# EAGLE design SD2IEC TicTac (EAGLE 7.7.0)
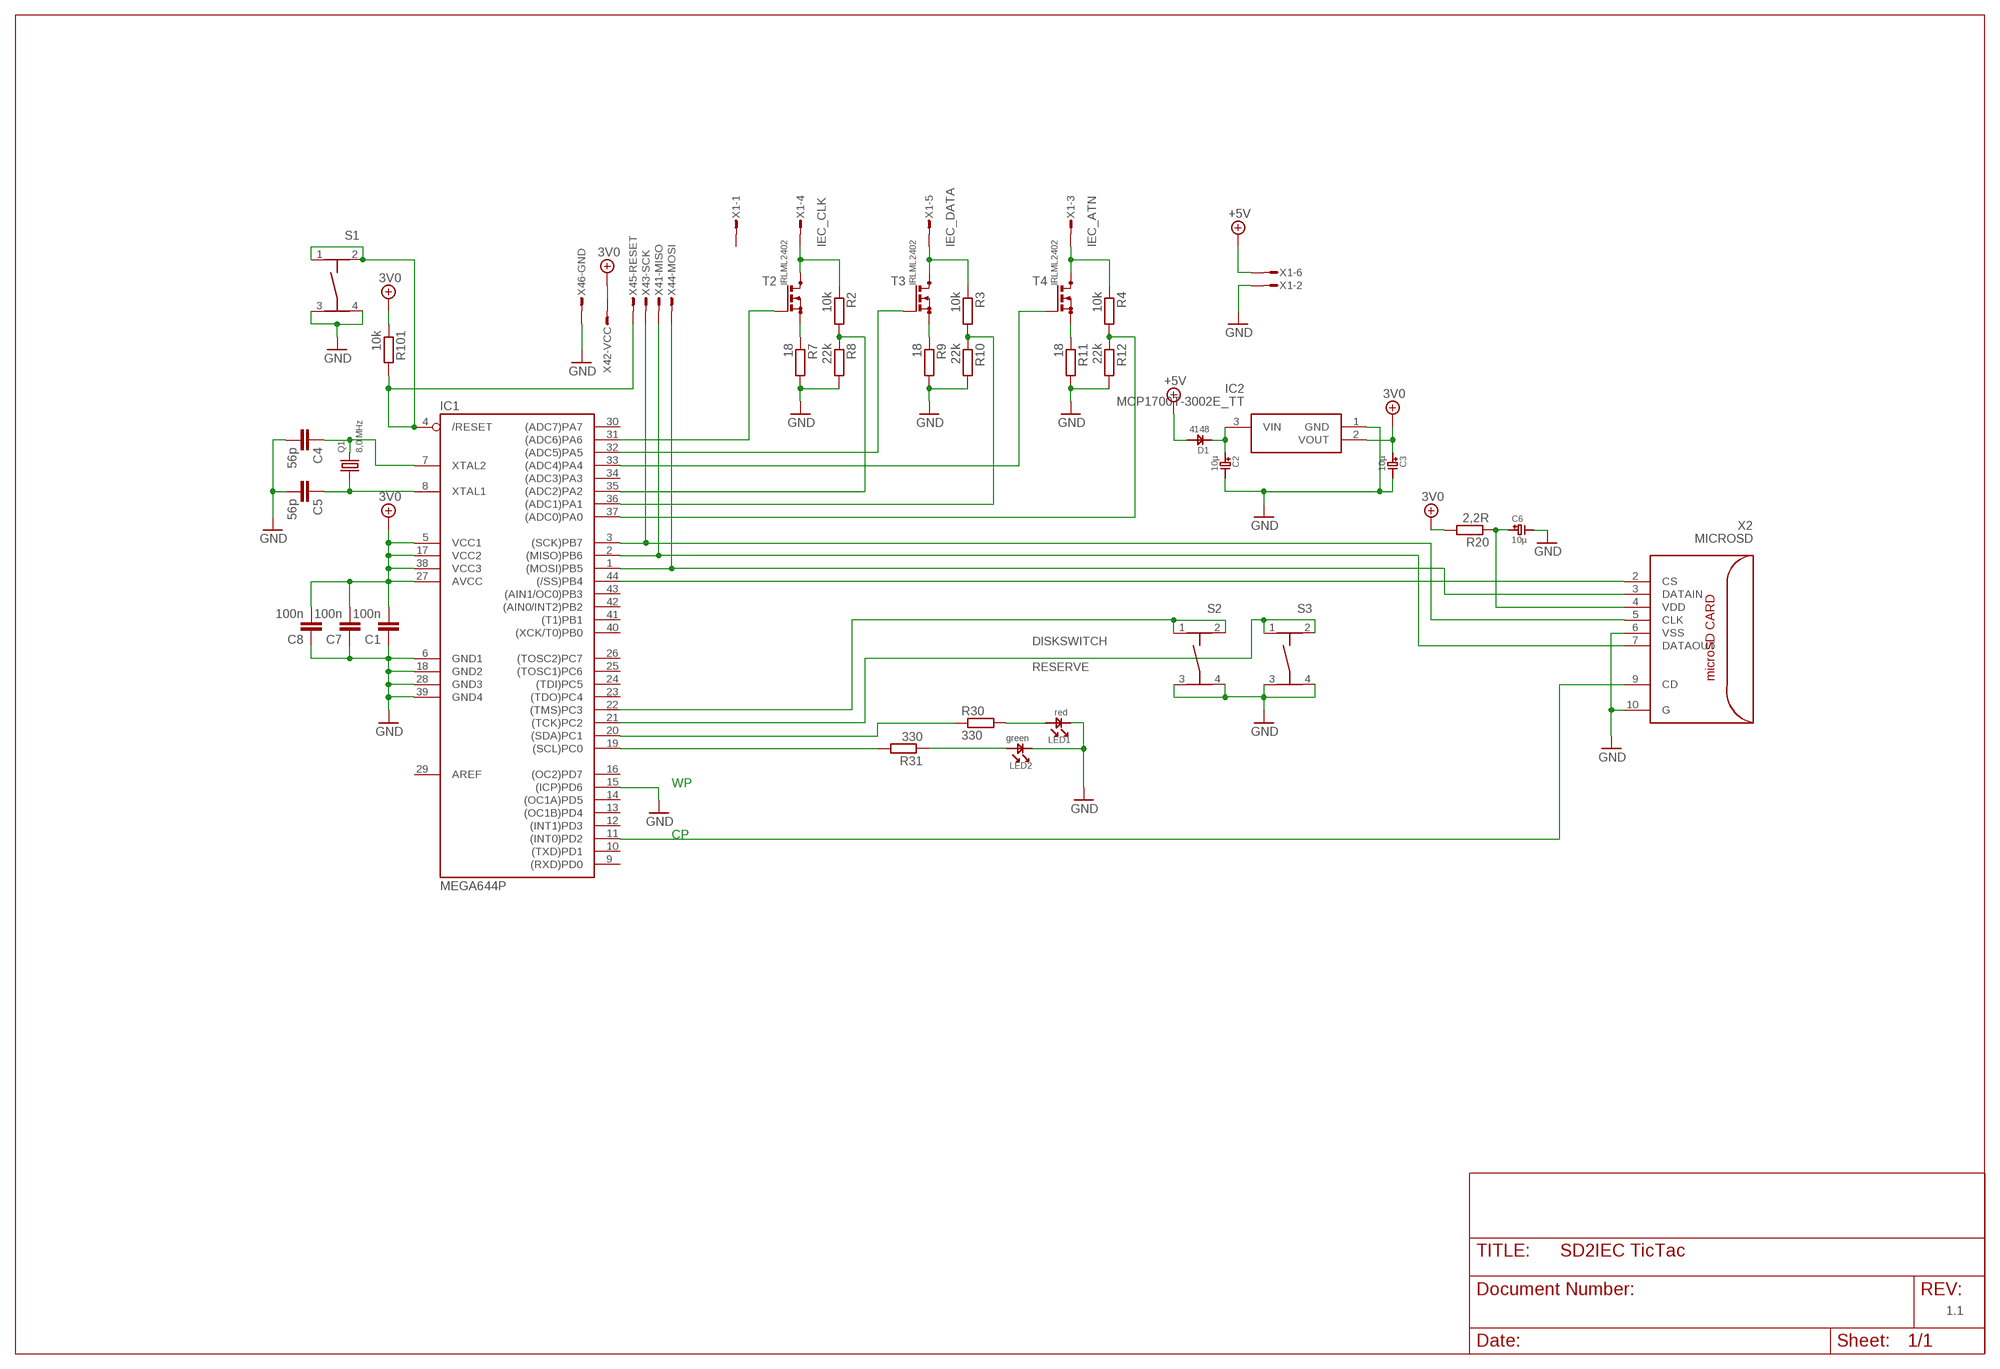
[diagram p0: schematic, sheet 1]

## Parts
C1  100n  C-EUC0805K  [C0805K]
C2  10µ  C_POLTA_A  [C_TANTAL_A]
C3  10µ  C_POLTA_A  [C_TANTAL_A]
C4  56p  C-EUC0805K  [C0805K]
C5  56p  C-EUC0805K  [C0805K]
C6  10µ  C_POLTA_A  [C_TANTAL_A]
C7  100n  C-EUC0805K  [C0805K]
C8  100n  C-EUC0805K  [C0805K]
D1  4148  DSOD-123  [SOD-123]
IC1  MEGA644P  MEGA16/32TQFP  [TQFP44]
IC2  MCP1700T-3002E_TT  [SOT95P237X112-3N]
LED1  red  LED1206  [LED1206]
LED2  green  LED1206  [LED1206]
Q1  8,0 MHz  HC49  [HC49/S]
R2  10k  R-EU_R0805  [R0805]
R3  10k  R-EU_R0805  [R0805]
R4  10k  R-EU_R0805  [R0805]
R7  18  R-EU_R0805  [R0805]
R8  22k  R-EU_R0805  [R0805]
R9  18  R-EU_R0805  [R0805]
R10  22k  R-EU_R0805  [R0805]
R11  18  R-EU_R0805  [R0805]
R12  22k  R-EU_R0805  [R0805]
R20  2,2R  R-EU_R0805  [R0805]
R30  330  R-EU_R0805  [R0805]
R31  330  R-EU_R0805  [R0805]
R101  10k  R-EU_R0805  [R0805]
S1  TASTER-9314_SMD  [TASTER-9314_SMD]
S2  TASTER-9314_SMD  [TASTER-9314_SMD]
S3  TASTER-9314_SMD  [TASTER-9314_SMD]
T2  IRLML2402  BSN20_C  [SOT23_C]
T3  IRLML2402  BSN20_C  [SOT23_C]
T4  IRLML2402  BSN20_C  [SOT23_C]
X1  MICROMATCH-6_PIN  [MICROMATCH-6]
X2  MICROSD  MICROSD_CHINA_SPI_MODE  [MICRO_SD_CONNECTOR]
X4  AVR-ISP_1X6  [1X6_ISP]

## Nets
3V0: C1.2 C3.1 C7.2 C8.2 IC1.5(VCC1) IC1.17(VCC2) IC1.27(AVCC) IC1.38(VCC3) IC2.2(VOUT) R20.2 R101.1 X4.2
+5V: D1.2 X1.6
/RESET: IC1.4(/RESET) R101.2 S1.1 S1.2 X4.5
ATN: IC1.37((ADC0)PA0) R4.2 R12.1
CLK: IC1.35((ADC2)PA2) R2.2 R8.1
DATA: IC1.36((ADC1)PA1) R3.2 R10.1
DISKSWITCH: IC1.22((TMS)PC3) S2.1 S2.2
GND: C1.1 C2.2 C3.2 C4.2 C5.2 C6.2 C7.1 C8.1 IC1.6(GND1) IC1.15((ICP)PD6) IC1.18(GND2) IC1.28(GND3) IC1.39(GND4) IC2.1(GND) LED1.1 LED2.1 R7.2 R8.2 R9.2 R10.2 R11.2 R12.2 S1.3 S1.4 S2.3 S2.4 S3.3 S3.4 X1.2 X2.6(VSS) X2.10(G) X4.6
IEC_ATN: R4.1 T4.3(D) X1.3
IEC_CLK: R2.1 T2.3(D) X1.4
IEC_DATA: R3.1 T3.3(D) X1.5
LED2: LED2.2 R31.1
MISO: IC1.2((MISO)PB6) X2.7(DATAOUT) X4.1
MOSI: IC1.1((MOSI)PB5) X2.3(DATAIN) X4.4
N$1: LED1.2 R30.2
N$2: C2.1 D1.1 IC2.3(VIN)
N$4: C5.1 IC1.8(XTAL1) Q1.1
N$5: C4.1 IC1.7(XTAL2) Q1.2
N$6: C6.1 R20.1 X2.4(VDD)
N$7: IC1.11((INT0)PD2) X2.9(CD)
N$17: IC1.32((ADC5)PA5) T3.1(G)
N$19: IC1.33((ADC4)PA4) T4.1(G)
N$20: IC1.31((ADC6)PA6) T2.1(G)
N$23: R7.1 T2.2(S)
N$24: R9.1 T3.2(S)
N$25: R11.1 T4.2(S)
PC0: IC1.19((SCL)PC0) R31.2
PC1: IC1.20((SDA)PC1) R30.1
RESERVE: IC1.21((TCK)PC2) S3.1 S3.2
SCK: IC1.3((SCK)PB7) X2.5(CLK) X4.3
SS: IC1.44((/SS)PB4) X2.2(CS)
Unconnected: IC1.9((RXD)PD0) IC1.10((TXD)PD1) IC1.12((INT1)PD3) IC1.13((OC1B)PD4) IC1.14((OC1A)PD5) IC1.16((OC2)PD7) IC1.23((TDO)PC4) IC1.24((TDI)PC5) IC1.25((TOSC1)PC6) IC1.26((TOSC2)PC7) IC1.29(AREF) IC1.30((ADC7)PA7) IC1.34((ADC3)PA3) IC1.40((XCK/T0)PB0) IC1.41((T1)PB1) IC1.42((AIN0/INT2)PB2) IC1.43((AIN1/OC0)PB3) X1.1

## Notes on the sheet
- WP
- CP
- 1.1

## Library data of the parts
C1 C4 C5 C7 C8 = rcl:C-EU: CAPACITOR, European symbol
C2 C3 C6 = 0_rr:C_POL
D1 = 0_rr:D
IC1 = 0_rr:MEGA16/32: MICROCONTROLLER 16 Kbytes FLASH, 512 bytes EEPROM 1 Kbytes SRAM dual UART hardware multiplier
IC2 = SamacSys_Parts:MCP1700T-3002E_TT: LDO voltage regulator 250mA Isupply 1uA Source: Datasheet <http://docs-europe.electrocomponents.com/webdocs/0dd1/0900766b80dd189b.pdf>; ALLIED_NUMBER: 70414541; ALLIED_PRICE/STOCK: http://www.alliedelec.com/microchip-technology-inc-mcp1700t-3002e-tt/70414541/; DESCRIPTION: LDO voltage regulator 250mA Isupply 1uA; HEIGHT: 1.12mm; MANUFACTURER_NAME: Microchip; MANUFACTURER_PART_NUMBER: MCP1700T-3002E/TT; RS_PART_NUMBER: 6989063P; RS_PRICE/STOCK: http://uk.rs-online.com/web/p/products/6989063P
LED1 LED2 = 0_rr:LED
Q1 = 0_rr:HC49
R2-R4 R7-R12 R20 R30 R31 R101 = rcl:R-EU_: RESISTOR, European symbol
S1-S3 = Ergaenzung:TASTER-9314_SMD
T2-T4 = 0_rr:BSN20: N-CHANNEL MOS FET
X1 = 0_rr:MICROMATCH-6: MicroMaTch 6 7-215464-6 / 0-215464-6 Drawing Number C-215464 DDEController.pdf
X2 = my_microsd:MICROSD_CHINA_SPI_MODE: TFP09-2-12B Fabricant: China SPI-Mode
X4 = 0_rr:AVR-ISP: MicroMaTch 6 7-215464-6 / 0-215464-6 Drawing Number C-215464 DDEController.pdf

## Board
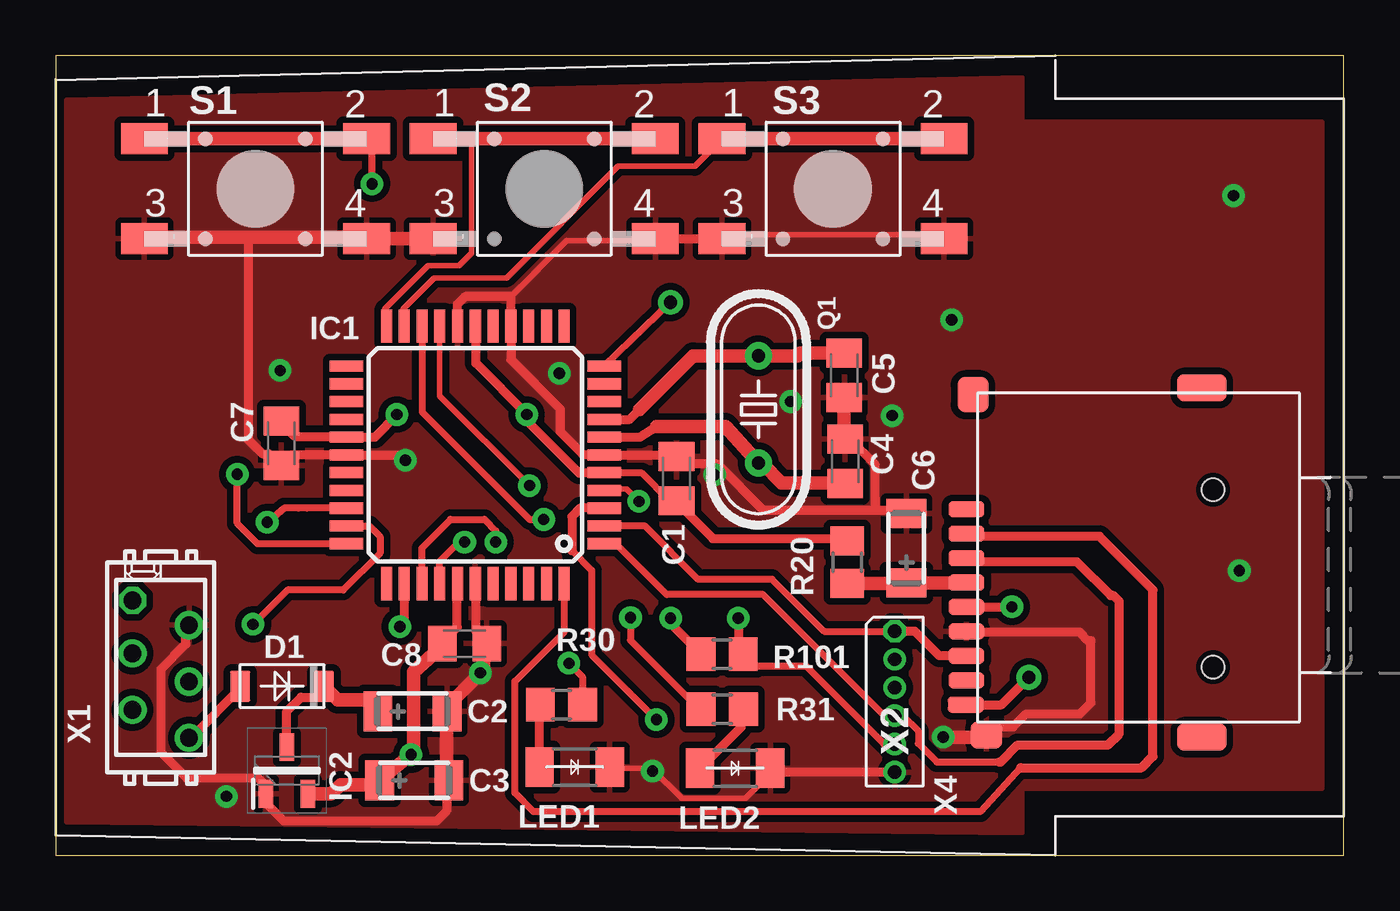
[diagram p1: board, top side]
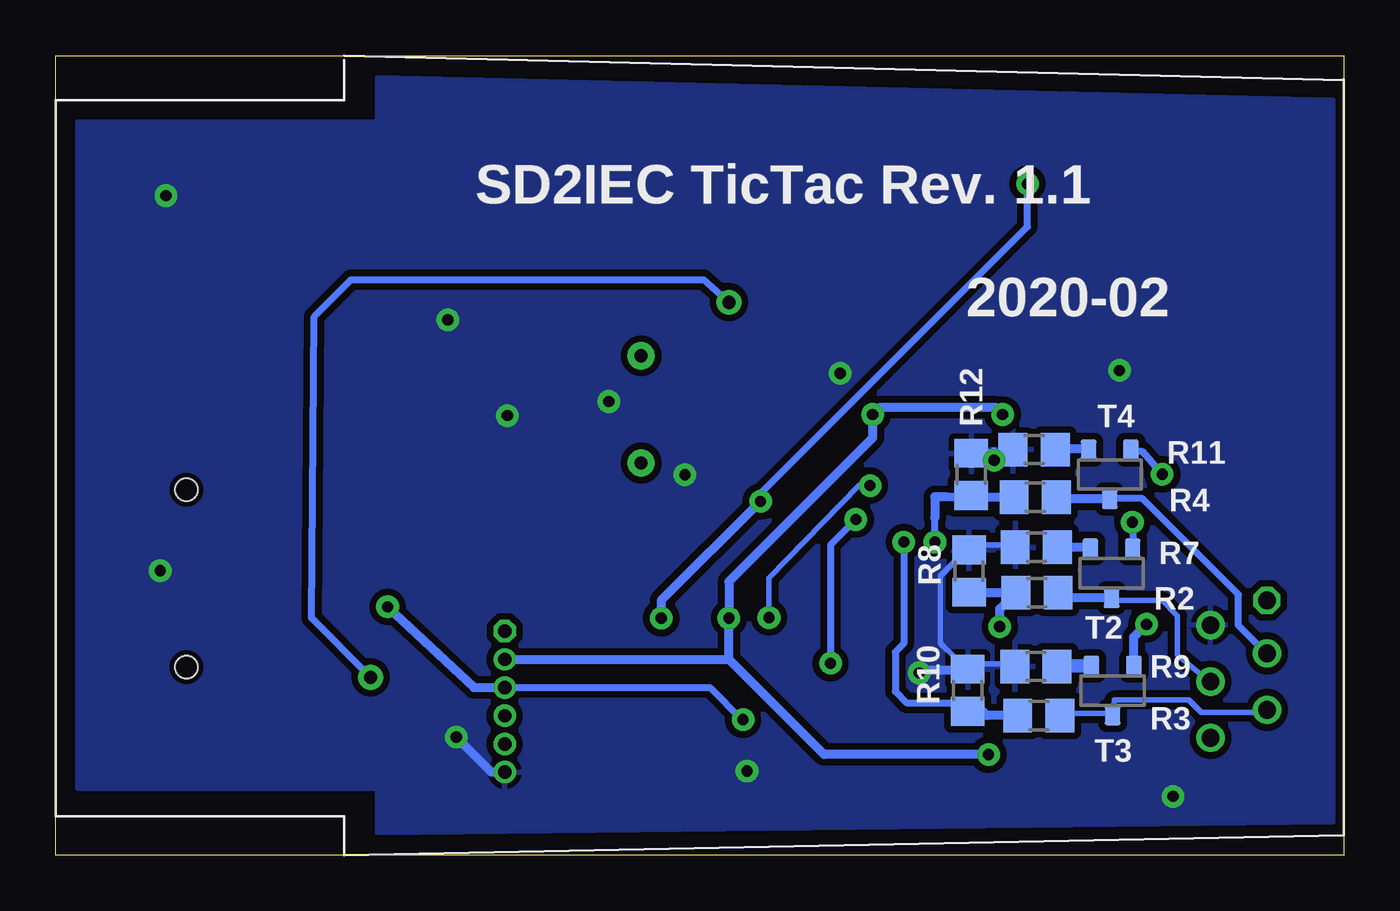
[diagram p2: board, bottom side, seen from below]

Size 58 x 36 mm. Coordinates in mm from the lower left corner, seen from the top.
Outline: 0,0 58,0 58,36 0,36 0,0
Copper layers (1*16): Top 0.035mm / dielectric 1.5mm / Bottom 0.035mm
Design rules "SparkFun *": minimum track width 10mil, minimum drill 20mil, track to track 12mil, track to pad 12mil, pad to pad 8mil, via to via 8mil, smd to smd 8mil, copper to edge 10mil, drill to drill 8mil, minimum pad ring 8mil, minimum via ring 10mil, stop-mask expansion 4mil, vias tented up to drill 25mil, thermal gap 10mil

### Footprints (pad centres in the part's own frame; a part is rotated, then mirrored left to right if it is on the bottom)
C0805K = smd 1.3 x 1.6: 1 -1,0; 2 1,0
C_TANTAL_A = smd 1.3 x 1.8: 1 1.559,0; 2 -1.559,0
SOD-123 = smd 0.914 x 1.397: 1 -1.884,0; 2 1.884,0
TQFP44 = smd 1.5 x 0.5: 1 -5.8,4; 2 -5.8,3.2; 3 -5.8,2.4; 4 -5.8,1.6; 5 -5.8,0.8; 6 -5.8,0; 7 -5.8,-0.8; 8 -5.8,-1.6; 9 -5.8,-2.4; 10 -5.8,-3.2; 11 -5.8,-4; 23 5.8,-4; 24 5.8,-3.2; 25 5.8,-2.4; 26 5.8,-1.6; 27 5.8,-0.8; 28 5.8,0; 29 5.8,0.8; 30 5.8,1.6; 31 5.8,2.4; 32 5.8,3.2; 33 5.8,4 | smd 0.5 x 1.5: 12 -4,-5.8; 13 -3.2,-5.8; 14 -2.4,-5.8; 15 -1.6,-5.8; 16 -0.8,-5.8; 17 0,-5.8; 18 0.8,-5.8; 19 1.6,-5.8; 20 2.4,-5.8; 21 3.2,-5.8; 22 4,-5.8; 34 4,5.8; 35 3.2,5.8; 36 2.4,5.8; 37 1.6,5.8; 38 0.8,5.8; 39 0,5.8; 40 -0.8,5.8; 41 -1.6,5.8; 42 -2.4,5.8; 43 -3.2,5.8; 44 -4,5.8
SOT95P237X112-3N = smd 1.25 x 0.65: 1 -1.05,0.95; 2 -1.05,-0.95; 3 1.05,0
LED1206 = smd 1.27 x 1.778: 1 -1.581,0; 2 1.581,0
HC49/S = drill 0.6 pad 1.219: 1 -2.413,0; 2 2.413,0
R0805 = smd 1.3 x 1.5: 1 -0.95,0; 2 0.95,0
TASTER-9314_SMD = smd 2.1 x 1.4: 1 -5,2.25; 2 5,2.25; 3 -5,-2.25; 4 5,-2.25
SOT23_C = smd 0.7 x 0.9: 1 -0.953,-1.111; 2 0.953,-1.111; 3 0,1.111
MICROMATCH-6 = drill 0.8 pad 1.118 octagon: 1 3.016,1.27 | drill 0.8 pad 1.27: 2 1.905,-1.27; 3 0.635,1.27; 4 -0.635,-1.27; 5 -1.905,1.27; 6 -3.175,-1.27
MICRO_SD_CONNECTOR = smd 0.7 x 1.6: 1 9.57,15; 2 8.47,15; 3 7.37,15; 4 6.27,15; 5 5.17,15; 6 4.07,15; 7 2.97,15; 8 1.87,15; 9 0.77,15.025 | smd 1.2 x 1.4: 10 -0.59,14.1 | smd 1.2 x 2.2: 11 -0.69,4.4; 12 15.035,4.4 | smd 1.6 x 1.4: 13 14.735,14.7 | hole 1: 2.47,3.9; 10.45,3.9
1X6_ISP = drill 0.6 pad 0.94 octagon: 1 0,0 | drill 0.6 pad 0.94: 2 1.27,0; 3 2.54,0; 4 3.81,0; 5 5.08,0; 6 6.35,0

### Placement (x,y rotation side)
C1  27.95,16.95 270 top
C2  16.07,6.48 180 top
C3  16.15,3.37 180 top
C4  35.54,17.73 90 top
C5  35.5,21.6 270 top
C6  38.3,13.82 270 top
C7  10.16,18.54 90 top
C8  18.41,9.53 180 top
D1  10.2,7.6 180 top
IC1  18.89,18.02 180 top
IC2  10.41,3.81 90 top
LED1  23.37,3.96 180 top
LED2  30.59,3.91 180 top
Q1  31.64,20.07 270 top
R2  13.82,11.81 180 bottom
R3  13.74,6.29 180 bottom
R4  13.9,16.11 180 bottom
R7  13.85,13.86 180 bottom
R8  16.88,12.79 90 bottom
R9  13.87,8.49 180 bottom
R10  16.94,7.42 90 bottom
R11  13.95,18.26 180 bottom
R12  16.78,17.14 90 bottom
R20  35.64,13.19 90 top
R30  22.77,6.78 180 top
R31  30.01,6.57 180 top
R101  30.01,9.05 0 top
S1  9,30 0 top
S2  22,30 0 top
S3  35,30 0 top
T2  10.46,12.69 180 bottom
T3  10.41,7.41 180 bottom
T4  10.54,17.14 180 bottom
X1  4.74,8.45 90 top
X2  56,6 90 top
X4  37.78,10.08 270 top

### Tracks (layer width: path | path; a pad name or v marks a point on that pad's centre or on a via)
3V0  (via drill 0.51)
  Top 0.254: 24.99,17.2 IC1.5 24.71,17.2 | 27.66,15.93 C1.2 28.19,15.65 | 18.92,23.82 IC1.17 | 35.48,14.25 R20.2 | 18.09,11.94 IC1.38 18.16,12.29 | 17.6,9.78 C8.2 | 12.72,18.85 IC1.27 13.13,18.82 | 10.34,19.28 C7.2 | v21.21,19.84 21.23,19.84
  Top 0.305: 24.99,17.2 26.39,17.2 27.66,15.93
  Top 0.406: 18.92,23.82 18.92,22.15 21.23,19.84 21.23,19.53 23.57,17.2 24.71,17.2 | 35.48,14.25 29.59,14.25 28.19,15.65 | 18.09,11.94 18.09,10.26 17.6,9.78 | 12.72,18.85 10.77,18.85 10.34,19.28 | 13.13,18.82 14.38,18.82 v15.37,19.84 | 14.4,3.17 C3.1 | v27.69,10.67 27.69,10.42 R101.1
  Top 0.61: C8.2 17.41,9.41 16.13,8.26 16.13,4.57 16.08,4.53 v16,4.53 C3.1 | IC2.2 12.41,2.76 12.83,3.17 14.4,3.17
  Bottom 0.406: v15.37,19.84 15.7,20.17 20.88,20.17 v21.21,19.84 | 21.21,19.43 v21.21,19.84 | v16,4.53 23.4,4.53 27.69,8.81 | v21.21,19.84 21.21,18.8 27.69,12.32 v27.69,10.67 27.69,8.81 | X4.2 27.69,8.81
+5V
  Top 0.254: 8.36,7.54 D1.2 | 6.12,5.31 X1.6
  Top 0.406: 6.12,5.31 8.36,7.54
/RESET  (via drill 0.51)
  Top 0.254: v26.26,15.93 25.7,16.48 24.87,16.48 IC1.4 | 14.25,32.13 S1.2
  Top 0.305: v14.25,30.23 14.25,32.13 | R101.2 31.5,8.51 33.78,8.51 37.29,5 X4.5
  Top 0.406: v30.73,10.67 30.73,9.05 R101.2
  Top 0.61: S1.1 S1.2
  Bottom 0.254: v26.26,15.93 26.29,16.26
  Bottom 0.305: v14.25,30.23 14.25,28.3 26.29,16.26
  Bottom 0.406: v26.26,15.93 30.73,11.46 v30.73,10.67
ATN  (via drill 0.51)
  Top 0.305: IC1.37 17.3,13.23 18.16,14.1 v18.41,14.1
  Bottom 0.305: v18.41,14.1 18.41,15.18
  Bottom 0.406: R4.2 16.7,16.11 R12.1 17.16,16.11 17.91,16.13 18.41,16.13 18.41,15.18
CLK  (via drill 0.51)
  Top 0.406: IC1.35 15.7,10.49 v15.49,10.29
  Bottom 0.406: R8.1 16.86,11.81 R2.2 15.49,11.09 v15.49,10.29
DATA  (via drill 0.51)
  Top 0.305: IC1.36 16.5,13.83 17.78,15.11 19.3,15.11 19.81,14.61 v19.81,14.1
  Bottom 0.305: v19.81,14.1 19.81,9.53 20.19,9.14 20.19,7.37 19.68,6.86 17.57,6.86 R10.1
  Bottom 0.406: R3.2 16.06,6.29 16.26,6.48 R10.1
DISKSWITCH
  Top 0.254: 18.72,32.25 18.72,27.1 18.16,26.54 16.76,26.54 14.81,24.59 14.81,24.03 IC1.22
  Top 0.61: S2.1 18.72,32.25 S2.2
GND  (via drill 0.51)
  Top 0.254: 10.06,17.6 C7.1 | 19.28,9.78 18.92,10.08 | 18.92,12.04 IC1.39 | 17.6,6.43 C2.2 18.14,7.21 | 17.6,3.63 C3.2 | 19.28,9.5 C8.1 | 5.87,10.34 X1.2 | 27.94,17.6 C1.1 | 38.28,15.52 C6.2 | 18.09,23.95 IC1.18 | 20.5,24.31 IC1.15 | 20.5,25.15 23.01,27.66 26.82,27.66 S2.4 | 35.48,20.4 C5.2 35.76,20.68 | 35.48,19 C4.2 35.76,18.72 | 39.95,27.66 S3.4 39.95,27.94 30.18,27.94 S3.3 | 42.47,5.77 41.91,5.59 X2.10 41.63,5.31 | 41.63,10.06 41.07,10.06 X2.6 | LED1.1 25.15,3.91 26.82,3.91 28.19,2.56 31.06,2.56 32.13,3.63 LED2.1
  Top 0.406: S2.4 S3.3 | 10.06,17.6 9.6,18.06 9.32,18.06 8.66,18.72 8.66,27.81 | 18.92,10.08 18.92,12.04 | 19.28,9.78 C8.1 | 5.87,10.34 5.87,9.5 4.75,8.38 4.75,4.62 5.92,3.45 9.15,3.45 9.46,3.14 IC2.1 9.53,2.7 9.53,2.29 10.29,1.52 17.14,1.52 17.6,1.98 17.6,3.63 | 28.32,17.6 29.79,17.6 31.88,15.52 36.88,15.52 | 28.32,17.6 27.94,17.6 | 38.28,15.52 36.88,15.52 | 18.09,23.95 18.09,24.79 18.44,25.15 20.5,25.15 20.5,24.31 | 36.88,15.52 36.88,17.6 35.76,18.72 | v15.75,17.78 15.75,18.02 IC1.28 10.64,18.02 C7.1 | 27.64,18.02 C1.1 | IC1.15 20.5,22.3 22.73,20.07 22.73,19.05 23.77,18.02 IC1.6 27.91,18.02 28.32,17.6 | X4.6 32.35,3.73 LED2.1 | 42.47,5.77 43.1,5.77 43.69,6.35 46.1,6.35 46.61,6.86 46.61,9.65 46.48,9.65 46.1,10.03 41.66,10.03 41.63,10.06
  Top 0.61: S2.3 S1.4 13.94,27.81 8.66,27.81 3.68,27.81 3.75,27.75 S1.3 | 17.6,3.63 17.6,6.43 | 19.28,9.5 19.28,8.1 v19.13,8.2 18.14,7.21 | 35.48,19 35.48,20.4 | v39.95,5.31 41.63,5.31
  Bottom 0.254: R7.2 14.81,13.97 16.76,13.97 R8.2 17.04,13.69 18.16,12.57 18.16,9.53 18.03,9.4 17.2,8.61 R10.2 | R10.2 16.92,8.61 14.96,8.61 R9.2 | v19.13,8.2 18.85,8.33 | 17.2,8.33 R10.2 | R11.2 15.09,18.16 15.75,18.16 16.76,18.16 R12.2
  Bottom 0.406: 18.85,8.33 17.2,8.33 | v15.75,17.78 15.75,18.16 | X4.6 38.38,3.73 v39.95,5.31
  other vias: 33.1,20.42 22.68,21.69 10.11,21.82 40.34,24.1 53.04,29.69 53.29,12.8 37.67,19.79 7.7,2.64 26.87,3.78 29.67,17.12
  pour Top: 0.5,1.5 43.5,1 43.5,3 57,3 57,33 43.5,33 43.5,35 0.5,34
  pour Bottom: 0.5,1.5 43.5,1 43.5,3 57,3 57,33 43.5,33 43.5,35 0.5,34
IEC_ATN
  Bottom 0.254: 10.46,16.05 T4.3 | 3.63,9.22 X1.3
  Bottom 0.305: 10.46,16.05 9.07,16.05 4.75,11.73 4.75,10.34 3.63,9.22
  Bottom 0.406: T4.3 12.6,16.03 12.7,16.13 12.93,16.13 R4.1
IEC_CLK
  Bottom 0.254: T2.3 10.34,11.46 8.18,11.46 7.49,10.77 7.49,9.02 6.15,7.9 6.02,7.82 X1.4
  Bottom 0.406: T2.3 12.47,11.58 12.7,11.81 R2.1
IEC_DATA
  Bottom 0.254: R3.1 12.72,6.38 10.49,6.38 T3.3 10.34,6.99 6.99,6.99 6.43,6.43 3.63,6.43 X1.5
LED2
  Top 0.406: R31.1 30.86,6.48 30.86,5.76 LED2.2
MISO
  Top 0.254: 24.87,14.81 IC1.2
  Top 0.305: 24.87,14.81 26.54,14.81 28.93,12.42 32.26,12.42 34.6,10.08 X4.1
  Top 0.406: X2.7 39.8,8.97 38.69,10.08 X4.1
MOSI
  Top 0.254: 24.87,13.97 IC1.1 | 37.59,6.3 X4.4 | 41.2,13.26 X2.3
  Top 0.305: 24.87,13.97 25.27,13.97 27.51,11.73 31.85,11.73 37.29,6.3 37.59,6.3 | 41.78,13.26 41.2,13.26 | 42.47,4.19 39.67,4.19 38.84,5.03 38.84,5.59 38.12,6.3 X4.4
  Top 0.406: 42.47,4.19 42.55,4.19 43.31,4.95 47.37,4.95 47.88,5.46 47.88,11.43 47.62,11.68 47.5,11.68 45.97,13.21 41.16,13.21 X2.3
N$1
  Top 0.406: LED1.2 21.79,6.74 R30.2
N$2
  Top 0.406: IC2.3 10.41,6.48 11.05,7.11 11.97,7.11 D1.1
  Top 0.61: D1.1 12.21,7.48 12.7,6.99 13.97,6.99 C2.1
N$4
  Top 0.406: 33.4,22.48 33.53,22.61 | IC1.8 25.84,19.62 26.29,20.07
  Top 0.61: 33.4,22.48 Q1.1 28.7,22.48 26.29,20.07 | 33.53,22.61 C5.1
N$5
  Top 0.254: 35.48,16.76 C4.1 | 31.85,17.6 Q1.2
  Top 0.406: IC1.7 26.31,18.82 27.05,19.3 | 30.15,19.3
  Top 0.61: 27.05,19.3 30.15,19.3 | 30.15,19.3 Q1.2 | 35.48,16.76 32.69,16.76 31.85,17.6
N$6
  Top 0.406: 38.28,12.24 C6.1 | X2.4
  Top 0.61: R20.1 38.28,12.24 | C6.1 X2.4
N$7  (via drill 0.6)
  Top 0.305: v27.69,24.89 IC1.11
  Top 0.406: X2.9 42.58,6.77 v43.81,8
  Bottom 0.305: v43.81,8 46.48,10.67 46.35,24.26 44.7,25.91 28.83,25.91 v27.69,24.89
N$17  (via drill 0.51)
  Top 0.305: IC1.32 14.14,14.82 14.61,14.35 14.61,13.59 12.95,11.94 10.44,11.94 v8.89,10.39
  Bottom 0.406: T3.1 9.46,9.82 v8.89,10.39
N$19  (via drill 0.51)
  Top 0.305: IC1.33 9.1,14.02 8.18,14.94 v8.18,17.14
  Bottom 0.254: 9.5,18.16 T4.1
  Bottom 0.305: 9.5,18.16 9.07,18.16 v8.18,17.14
N$20  (via drill 0.51)
  Top 0.305: IC1.31 11.31,15.62 10.92,15.62 10.29,15.62 v9.53,14.99
  Bottom 0.254: 9.5,13.97 T2.1
  Bottom 0.305: v9.53,14.99 9.5,13.97
N$23
  Bottom 0.406: T2.2 11.41,13.83 11.43,13.84 12.88,13.84 R7.1
N$24
  Bottom 0.61: T3.2 12.89,8.52 R9.1
N$25
  Bottom 0.406: T4.2 11.52,18.25 11.56,18.29 12.97,18.29 R11.1
PC0  (via drill 0.51)
  Top 0.254: v21.34,16.64 17.3,20.68 17.3,23.14 17.32,23.42 17.32,23.75 IC1.19
  Top 0.305: R31.2 28.57,7.11 28.45,7.11 25.88,9.68 v25.88,10.69
  Bottom 0.254: v25.88,10.69 25.88,12.47 21.84,16.64 v21.34,16.64
PC1  (via drill 0.51)
  Top 0.305: IC1.20 16.51,19.94 21.34,15.11 v21.97,15.11 | v23.11,8.64 23.72,8.03 R30.1
  Bottom 0.305: v21.97,15.11 23.11,13.97 v23.11,8.64
RESERVE
  Top 0.254: IC1.21 15.65,24.03 15.65,24.59 17.04,25.98 20.3,25.98 25.32,31.01 28.78,31.01 29.9,32.13 S3.1
  Top 0.61: S3.1 S3.2
SCK  (via drill 0.51)
  Top 0.305: 23.24,13.72 24.13,12.83 24.13,9.02 v27.05,6.1
  Top 0.406: IC1.3 23.62,15.62 23.24,15.24 23.24,13.72 | X2.5 v43.05,11.18
  Bottom 0.254: 37.72,7.54 X4.3
  Bottom 0.305: 37.72,7.54 28.55,7.54 27.1,6.1 v27.05,6.1
  Bottom 0.406: v43.05,11.18 39.16,7.54 X4.3
SS
  Top 0.254: 41.78,14.38 41.2,14.38 X2.2 | 22.91,12.01 IC1.44
  Top 0.305: 22.91,12.01 22.91,10.06 20.68,7.82 20.68,2.79 21.51,1.96 41.63,1.96 43.43,3.94
  Top 0.406: 43.43,3.94 48.9,3.94 49.4,4.45 49.4,11.94 46.99,14.35 41.12,14.35 X2.2

### Text on the board
bPlace: SD2IEC TicTac Rev. 1.1 | 2020-02